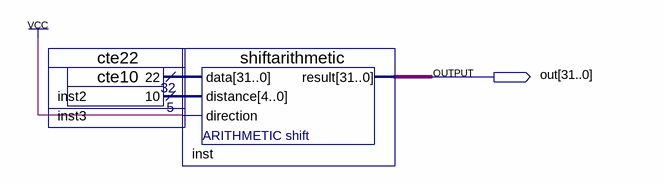
[diagram p0: schematic sheet]
// Quartus schematic testebreg.bdf as structural Verilog: 3 symbols, 1 pins
module testebreg (
  output [31:0] out
);

  wire [4:0] inst3_result;
  wire [31:0] inst2_result;

  cte22 inst2 (.result(inst2_result));
  cte10 inst3 (.result(inst3_result));
  shiftarithmetic inst (.data(inst2_result), .distance(inst3_result), .direction(1'b1), .result(out));
endmodule
